# EAGLE schematic SNCHN_II-01 (EAGLE 5.11)
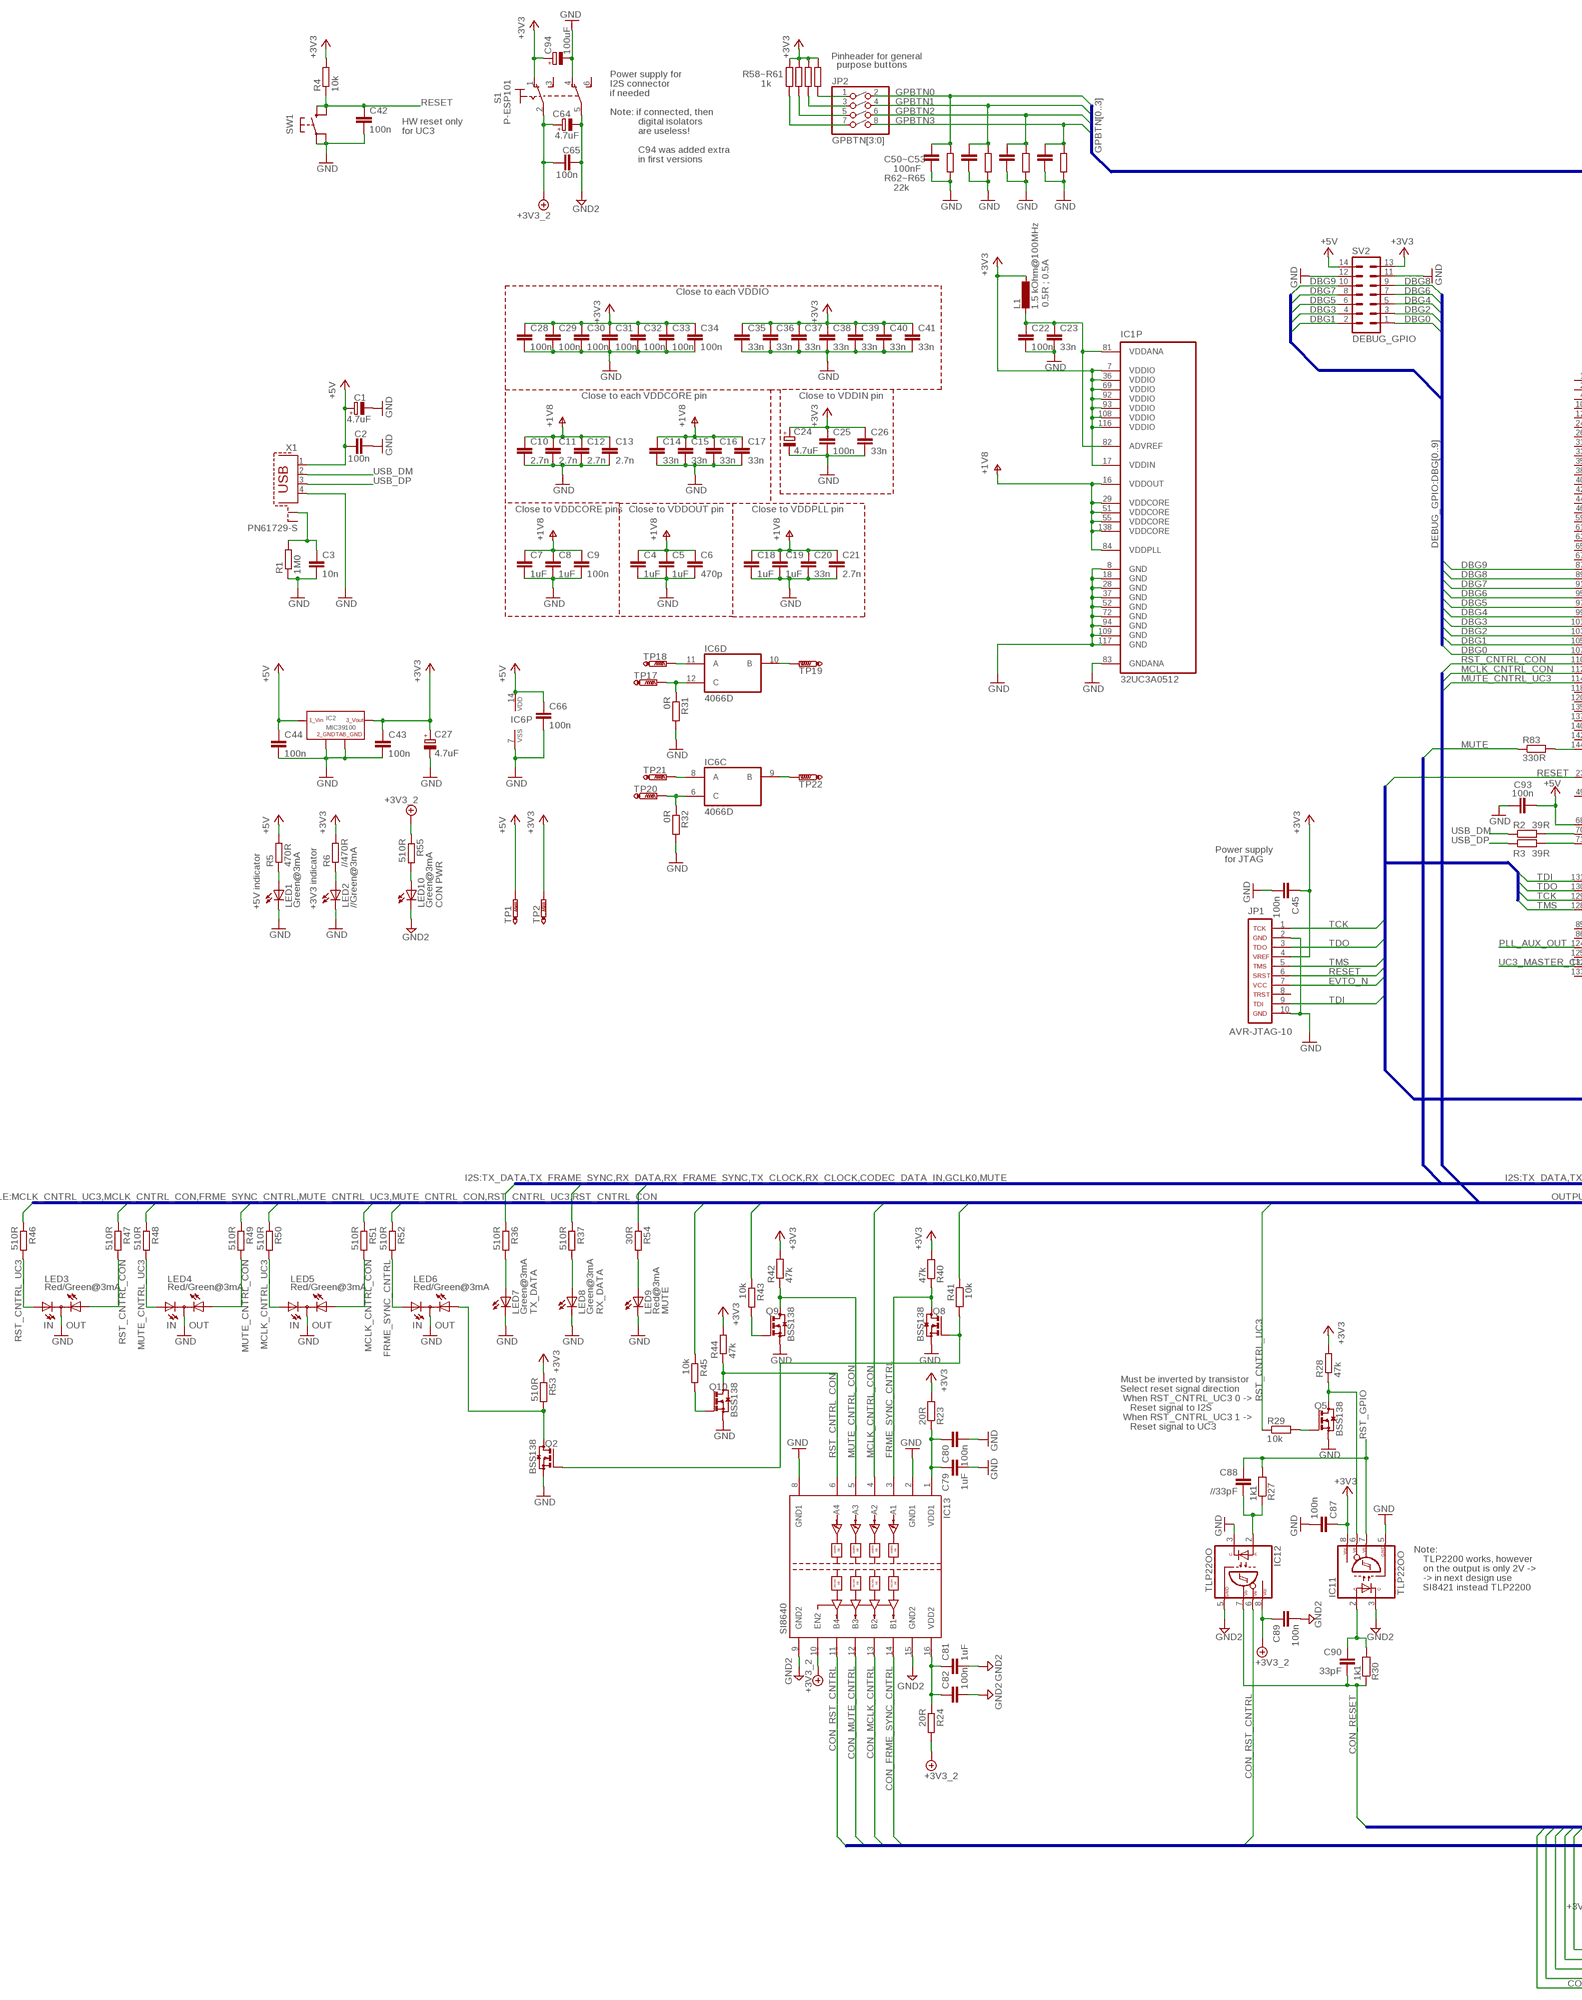
[diagram p0: schematic, sheet 1, part 1 of 3]
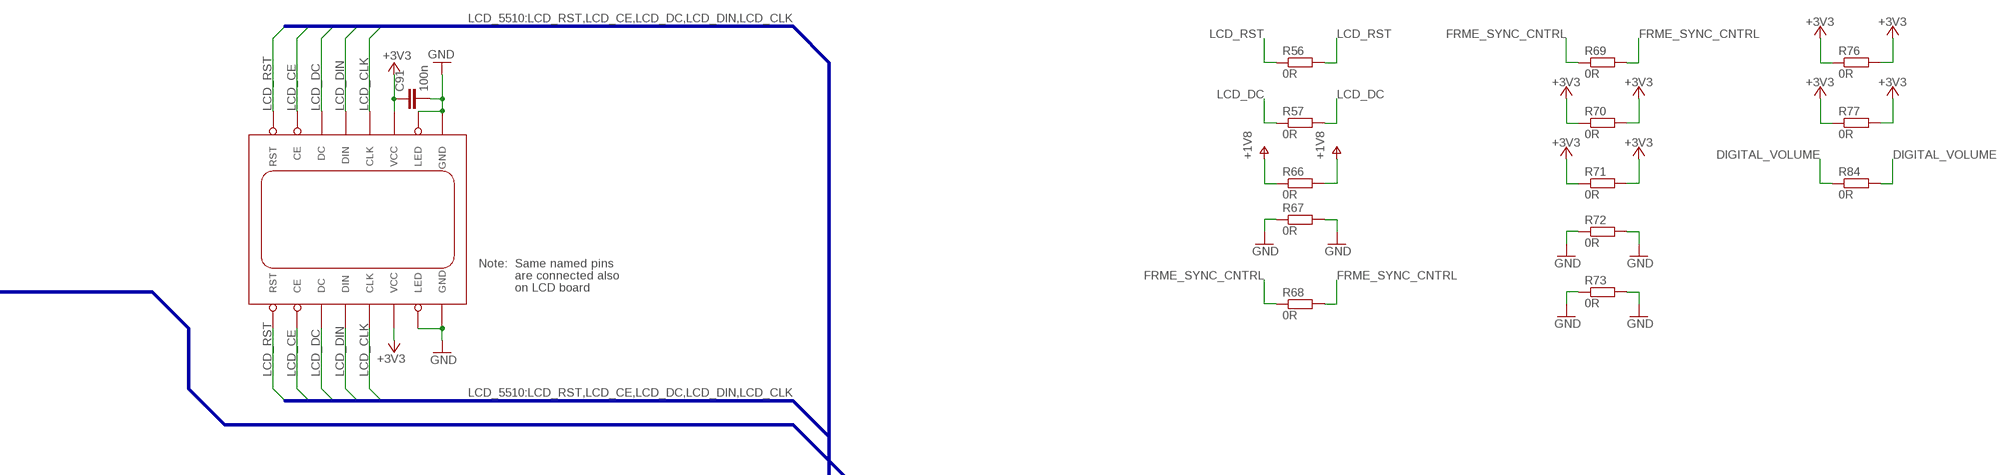
[diagram p1: schematic, sheet 1, part 2 of 3]
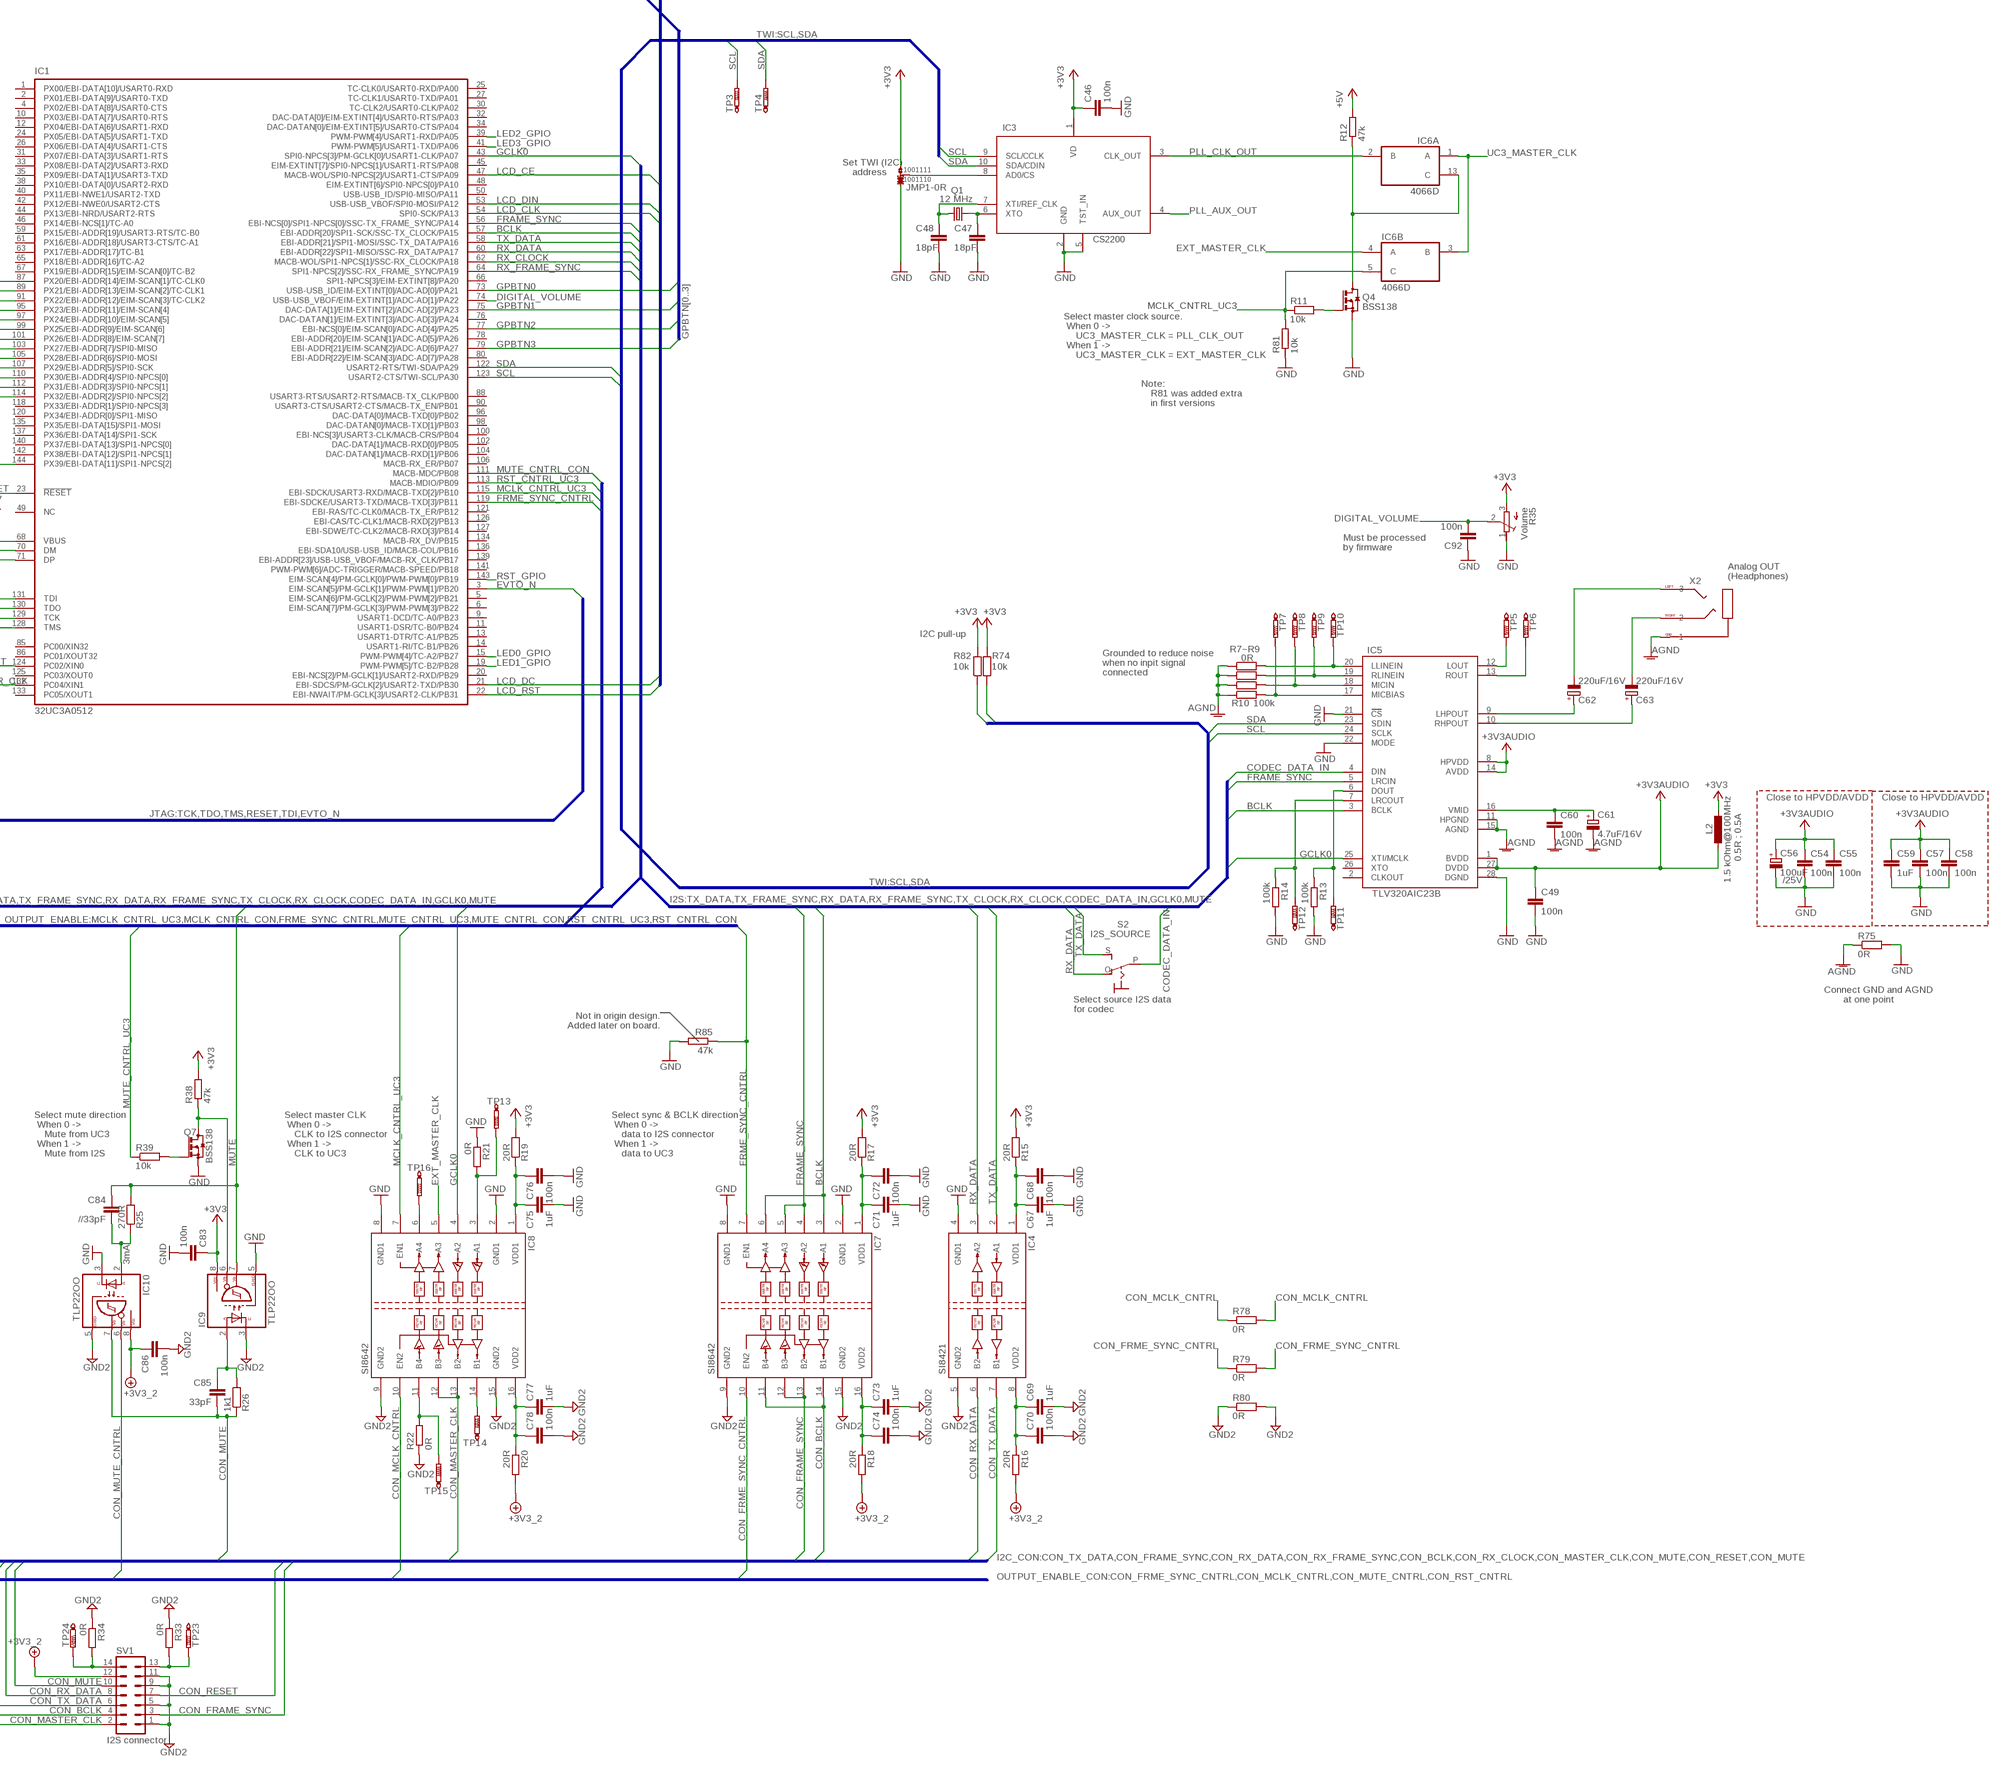
[diagram p2: schematic, sheet 1, part 3 of 3]

## Parts
C1  4.7uF  CPOL-EUA/3216-18R  [A/3216-18R]
C2  100n  C0402  [C0402K]
C3  10n  C0402  [C0402K]
C4  1uF  C0603R  [C0603R]
C5  1uF  C0603R  [C0603R]
C6  470p  C0402  [C0402K]
C7  1uF  C0603R  [C0603R]
C8  1uF  C0603R  [C0603R]
C9  100n  C0402  [C0402K]
C10  2.7n  C0402  [C0402K]
C11  2.7n  C0402  [C0402K]
C12  2.7n  C0402  [C0402K]
C13  2.7n  C0402  [C0402K]
C14  33n  C0402  [C0402K]
C15  33n  C0402  [C0402K]
C16  33n  C0402  [C0402K]
C17  33n  C0402  [C0402K]
C18  1uF  C0603R  [C0603R]
C19  1uF  C0603R  [C0603R]
C20  33n  C0402  [C0402K]
C21  2.7n  C0402  [C0402K]
C22  100n  C0402  [C0402K]
C23  33n  C0402  [C0402K]
C24  4.7uF  CPOL-EUA/3216-18R  [A/3216-18R]
C25  100n  C0402  [C0402K]
C26  33n  C0402  [C0402K]
C27  4.7uF  CPOL-EUA/3216-18R  [A/3216-18R]
C28  100n  C0402  [C0402K]
C29  100n  C0402  [C0402K]
C30  100n  C0402  [C0402K]
C31  100n  C0402  [C0402K]
C32  100n  C0402  [C0402K]
C33  100n  C0402  [C0402K]
C34  100n  C0402  [C0402K]
C35  33n  C0402  [C0402K]
C36  33n  C0402  [C0402K]
C37  33n  C0402  [C0402K]
C38  33n  C0402  [C0402K]
C39  33n  C0402  [C0402K]
C40  33n  C0402  [C0402K]
C41  33n  C0402  [C0402K]
C42  100n  C0402  [C0402K]
C43  100n  C0402  [C0402K]
C44  100n  C0402  [C0402K]
C45  100n  C0402  [C0402K]
C46  100n  C0402  [C0402K]
C47  18pF  C0402  [C0402K]
C48  18pF  C0402  [C0402K]
C49  100n  C0402  [C0402K]
C50  100n  C0402  [C0402K]
C51  100n  C0402  [C0402K]
C52  100n  C0402  [C0402K]
C53  100n  C0402  [C0402K]
C54  100n  C0402  [C0402K]
C55  100n  C0402  [C0402K]
C56  100uF  CPOL-EUD/7343-31R  [D/7343-31R]
C57  100n  C0402  [C0402K]
C58  100n  C0402  [C0402K]
C59  1uF  C0603R  [C0603R]
C60  100n  C0402  [C0402K]
C61  4.7uF/16V  CPOL-EUA/3216-18R  [A/3216-18R]
C62  220uF/16V  CPOL-EU140CLH-1010  [140CLH-1010]
C63  220uF/16V  CPOL-EU140CLH-1010  [140CLH-1010]
C64  4.7uF  CPOL-EUA/3216-18R  [A/3216-18R]
C65  100n  C0402  [C0402K]
C66  100n  C0402  [C0402K]
C67  1uF  C0603R  [C0603R]
C68  100n  C0402  [C0402K]
C69  1uF  C0603R  [C0603R]
C70  100n  C0402  [C0402K]
C71  1uF  C0603R  [C0603R]
C72  100n  C0402  [C0402K]
C73  1uF  C0603R  [C0603R]
C74  100n  C0402  [C0402K]
C75  1uF  C0603R  [C0603R]
C76  100n  C0402  [C0402K]
C77  1uF  C0603R  [C0603R]
C78  100n  C0402  [C0402K]
C79  1uF  C0603R  [C0603R]
C80  100n  C0402  [C0402K]
C81  1uF  C0603R  [C0603R]
C82  100n  C0402  [C0402K]
C83  100n  C0402  [C0402K]
C84  //33pF  C0402  [C0402K]
C85  33pF  C0402  [C0402K]
C86  100n  C0402  [C0402K]
C87  100n  C0402  [C0402K]
C88  //33pF  C0402  [C0402K]
C89  100n  C0402  [C0402K]
C90  33pF  C0402  [C0402K]
C91  100n  C0402  [C0402K]
C92  100n  C0402  [C0402K]
C93  100n  C0402  [C0402K]
C94  100uF  CPOL-EUD/7343-31R  [D/7343-31R]
DIS1  LCD_NOKIA_5510  [LCD_NOKIA_5510_PLUS_EXT_BRD]
IC1  32UC3A0512  AT32UC3A0128/0256/0512  [LQFP144]
IC2  MIC39100  [SOT223(S)]
IC3  CS2200  [MSOP10]
IC4  SI8421  [SOIC8]
IC5  TLV320AIC23B  TLV320AIC23BTSSOP  [TSSOP28]
IC6  4066D  [SO14]
IC7  SI8642  [QSOP16]
IC8  SI8642  [QSOP16]
IC9  TLP22OO  [DIL08]
IC10  TLP22OO  [DIL08]
IC11  TLP22OO  [DIL08]
IC12  TLP22OO  [DIL08]
IC13  SI8640  SI8640SOIC16N  [SOIC16N]
JMP1  0R-JUMPA  [A0R-JMP]
JP1  AVR-JTAG-10  [AVR-JTAG-10]
JP2  GPBTN[3:0]  PINHD-2X4  [2X04]
L1  1.5 kOhm@100MHz  L0603  [L0603]
L2  1.5 kOhm@100MHz  L0603  [L0603]
LED1  Green@3mA  LED0603  [LED-0603]
LED2  //Green@3mA  LED0603  [LED-0603]
LED3  Red/Green@3mA  DUO_LED_C3MM  [DUOLED-C-3MM]
LED4  Red/Green@3mA  DUO_LED_C3MM  [DUOLED-C-3MM]
LED5  Red/Green@3mA  DUO_LED_C3MM  [DUOLED-C-3MM]
LED6  Red/Green@3mA  DUO_LED_C3MM  [DUOLED-C-3MM]
LED7  Green@3mA  LED3MM  [LED3MM]
LED8  Green@3mA  LED3MM  [LED3MM]
LED9  Red@3mA  LED3MM  [LED3MM]
LED10  Green@3mA  LED3MM  [LED3MM]
Q1  12 MHz  CRYSTALHC49UP  [HC49UP]
Q2  BSS138  BSS123  [SOT23]
Q4  BSS138  BSS123  [SOT23]
Q5  BSS138  BSS123  [SOT23]
Q7  BSS138  BSS123  [SOT23]
Q8  BSS138  BSS123  [SOT23]
Q9  BSS138  BSS123  [SOT23]
Q10  BSS138  BSS123  [SOT23]
R1  1M0  R0402  [R0402]
R2  39R  R0402  [R0402]
R3  39R  R0402  [R0402]
R4  10k  R0402  [R0402]
R5  470R  R0402  [R0402]
R6  //470R  R0402  [R0402]
R7  0R  R0805  [R0805]
R8  0R  R0805  [R0805]
R9  0R  R0805  [R0805]
R10  100k  R0805  [R0805]
R11  10k  R0402  [R0402]
R12  47k  R0402  [R0402]
R13  100k  R0805  [R0805]
R14  100k  R0805  [R0805]
R15  20R  R0402  [R0402]
R16  20R  R0402  [R0402]
R17  20R  R0402  [R0402]
R18  20R  R0402  [R0402]
R19  20R  R0603  [R0603]
R20  20R  R0402  [R0402]
R21  0R  R0805  [R0805]
R22  0R  R0805  [R0805]
R23  20R  R0402  [R0402]
R24  20R  R0402  [R0402]
R25  270R  R0402  [R0402]
R26  1k1  R0402  [R0402]
R27  1k1  R0402  [R0402]
R28  47k  R0603  [R0603]
R29  10k  R0603  [R0603]
R30  1k1  R0402  [R0402]
R31  0R  R0805  [R0805]
R32  0R  R0805  [R0805]
R33  0R  R0805  [R0805]
R34  0R  R0805  [R0805]
R35  Volume  R-TRIMTRIM_3352T  [TRIM_3352T]
R36  510R  R0402  [R0402]
R37  510R  R0603  [R0603]
R38  47k  R0402  [R0402]
R39  10k  R0603  [R0603]
R40  47k  R0402  [R0402]
R41  10k  R0402  [R0402]
R42  47k  R0402  [R0402]
R43  10k  R0402  [R0402]
R44  47k  R0402  [R0402]
R45  10k  R0402  [R0402]
R46  510R  R0402  [R0402]
R47  510R  R0603  [R0603]
R48  510R  R0402  [R0402]
R49  510R  R0603  [R0603]
R50  510R  R0603  [R0603]
R51  510R  R0402  [R0402]
R52  510R  R0402  [R0402]
R53  510R  R0402  [R0402]
R54  30R  R0402  [R0402]
R55  510R  R0402  [R0402]
R56  0R  R0603  [R0603]
R57  0R  R0603  [R0603]
R58  1k  R0402  [R0402]
R59  1k  R0402  [R0402]
R60  1k  R0402  [R0402]
R61  1k  R0402  [R0402]
R62  22k  R0402  [R0402]
R63  22k  R0402  [R0402]
R64  22k  R0402  [R0402]
R65  22k  R0402  [R0402]
R66  0R  R0603  [R0603]
R67  0R  R1206  [R1206]
R68  0R  R0603  [R0603]
R69  0R  R0603  [R0603]
R70  0R  R1206  [R1206]
R71  0R  R0603  [R0603]
R72  0R  R0603  [R0603]
R73  0R  R1206  [R1206]
R74  10k  R-EU_R0603  [R0603]
R75  0R  R0603  [R0603]
R76  0R  R0603  [R0603]
R77  0R  R0603  [R0603]
R78  0R  R0603  [R0603]
R79  0R  R0603  [R0603]
R80  0R  R0603  [R0603]
R81  10k  R0402  [R0402]
R82  10k  R0402  [R0402]
R83  330R  R0402  [R0402]
R84  0R  R1206  [R1206]
R85  47k  R0402  [R0402]
S1  P-ESP101  SLIDE_SWITCH_THRUHOLE  [JS202011AQN]
S2  I2S_SOURCE  SLIDE_SWITCH_THRUHOLE_1_POLE_HORIZONTAL  [P-ESP201X]
SV1  I2S connector  ML14L  [ML14L]
SV2  DEBUG_GPIO  ML14L  [ML14L]
SW1  B1720SMD  [B1720/SMD]
TP1  PTR1B1,27  [B1,27]
TP2  PTR1B1,27  [B1,27]
TP3  PTR1PAD1-13  [P1-13]
TP4  PTR1PAD1-13  [P1-13]
TP5  PTR1B1,27  [B1,27]
TP6  PTR1B1,27  [B1,27]
TP7  PTR1B1,27  [B1,27]
TP8  PTR1B1,27  [B1,27]
TP9  PTR1B1,27  [B1,27]
TP10  PTR1B1,27  [B1,27]
TP11  PTR1B1,27  [B1,27]
TP12  PTR1B1,27  [B1,27]
TP13  PTR1B1,27  [B1,27]
TP14  PTR1B1,27  [B1,27]
TP15  PTR1B1,27  [B1,27]
TP16  PTR1B1,27  [B1,27]
TP17  PTR1B1,27  [B1,27]
TP18  PTR1B1,27  [B1,27]
TP19  PTR1B1,27  [B1,27]
TP20  PTR1B1,27  [B1,27]
TP21  PTR1B1,27  [B1,27]
TP22  PTR1B1,27  [B1,27]
TP23  PTR1B1,27  [B1,27]
TP24  PTR1B1,27  [B1,27]
X1  PN61729-S  [PN61729-S]
X2  JACK_CON_3.5MM_3PIN  [STEREO_JACK_3.5MM_SMD_SJ-352X-SMT]

## Nets
+1V8: C4.1 C5.1 C6.1 C7.1 C8.1 C9.1 C10.1 C11.1 C12.1 C13.1 C14.1 C15.1 C16.1 C17.1 C18.1 C19.1 C20.1 C21.1 IC1.16(VDDOUT) IC1.29(VDDCORE) IC1.51(VDDCORE) IC1.55(VDDCORE) IC1.84(VDDPLL) IC1.138(VDDCORE) R66.1 R66.2
+3V3: C24.+ C25.1 C26.1 C27.+ C28.1 C29.1 C30.1 C31.1 C32.1 C33.1 C34.1 C35.1 C36.1 C37.1 C38.1 C39.1 C40.1 C41.1 C43.1 C45.1 C46.1 C83.1 C87.1 C91.1 C94.+ DIS1.6(VCC) DIS1.6@1(VCC) IC1.7(VDDIO) IC1.17(VDDIN) IC1.36(VDDIO) IC1.69(VDDIO) IC1.92(VDDIO) IC1.93(VDDIO) IC1.108(VDDIO) IC1.116(VDDIO) IC2.3 IC3.1(VD) IC9.8(VCC) IC11.8(VCC) JMP1.3 JP1.4 L1.1 L2.1 R4.2 R6.2 R15.2 R17.2 R19.2 R23.2 R28.2 R35.3 R38.2 R40.2 R42.2 R44.2 R53.1 R58.2 R59.2 R60.2 R61.2 R70.1 R70.2 R71.1 R71.2 R74.2 R76.1 R76.2 R77.1 R77.2 R82.2 S1.1(O) SV2.13 TP2.PP(TP)
+3V3_2: C64.+ C65.1 C86.1 C89.1 IC10.8(VCC) IC12.8(VCC) IC13.10(EN2) R16.2 R18.2 R20.2 R24.2 R55.1 S1.2(P) SV1.12
+3V3AUDIO: C49.1 C54.1 C55.1 C56.+ C57.1 C58.1 C59.1 IC5.1(BVDD) IC5.8(HPVDD) IC5.14(AVDD) IC5.27(DVDD) L2.2
+5V: C1.+ C2.1 C44.1 C66.1 C93.2 IC1.68(VBUS) IC2.1 IC6.14(P:VDD) R5.2 R12.2 SV2.14 TP1.PP(TP) X1.1
AGND: C60.2 C61.- IC5.11(HPGND) IC5.15(AGND) R7.1 R8.1 R9.1 R10.1 R75.1 X2.P$1
BCLK: IC1.57(EBI-ADDR[20]/SPI1-SCK/SSC-TX_CLOCK/PA15) IC5.3(BCLK) IC7.3(A1) IC7.6(A4)
CODEC_DATA_IN: IC5.4(DIN) S2.P
CON_BCLK: IC7.11(B4) IC7.14(B1) SV1.4
CON_FRAME_SYNC: IC7.12(B3) IC7.13(B2) SV1.3
CON_FRME_SYNC_CNTRL: IC7.10(EN2) IC13.14(B1) R79.1 R79.2
CON_MASTER_CLK: IC8.12(B3) IC8.13(B2) SV1.2
CON_MCLK_CNTRL: IC8.10(EN2) IC13.13(B2) R78.1 R78.2
CON_MUTE: C85.2 IC10.7(VO) R26.1 SV1.10
CON_MUTE_CNTRL: IC10.6(VE) IC13.12(B3)
CON_RESET: C90.2 IC12.7(VO) R30.1 SV1.7
CON_RST_CNTRL: IC12.6(VE) IC13.11(B4)
CON_RX_DATA: IC4.6(B2) SV1.8
CON_TX_DATA: IC4.7(B1) SV1.6
DBG0: IC1.107(PX29/EBI-ADDR[5]/SPI0-SCK) SV2.1
DBG1: IC1.105(PX28/EBI-ADDR[6]/SPI0-MOSI) SV2.2
DBG2: IC1.103(PX27/EBI-ADDR[7]/SPI0-MISO) SV2.3
DBG3: IC1.101(PX26/EBI-ADDR[8]/EIM-SCAN[7]) SV2.4
DBG4: IC1.99(PX25/EBI-ADDR[9]/EIM-SCAN[6]) SV2.5
DBG5: IC1.97(PX24/EBI-ADDR[10]/EIM-SCAN[5]) SV2.6
DBG6: IC1.95(PX23/EBI-ADDR[11]/EIM-SCAN[4]) SV2.7
DBG7: IC1.91(PX22/EBI-ADDR[12]/EIM-SCAN[3]/TC-CLK2) SV2.8
DBG8: IC1.89(PX21/EBI-ADDR[13]/EIM-SCAN[2]/TC-CLK1) SV2.9
DBG9: IC1.87(PX20/EBI-ADDR[14]/EIM-SCAN[1]/TC-CLK0) SV2.10
DIGITAL_VOLUME: C92.2 IC1.74(USB-USB_VBOF/EIM-EXTINT[1]/ADC-AD[1]/PA22) R35.2 R84.1 R84.2
EVTO_N: IC1.3(EIM-SCAN[5]/PM-GCLK[1]/PWM-PWM[1]/PB20) JP1.7
EXT_MASTER_CLK: IC6.4(B:A) IC8.5(A3)
FRAME_SYNC: IC1.56(EBI-NCS[0]/SPI1-NPCS[0]/SSC-TX_FRAME_SYNC/PA14) IC5.5(LRCIN) IC7.4(A2) IC7.5(A3)
FRME_SYNC_CNTRL: IC1.119(EBI-SDCKE/USART3-TXD/MACB-TXD[3]/PB11) IC7.7(EN1) R41.1 R52.1 R68.1 R68.2 R69.1 R69.2 R85.1
GCLK0: IC1.43(SPI0-NPCS[3]/PM-GCLK[0]/USART1-CLK/PA07) IC5.25(XTI/MCLK) IC8.4(A2)
GND: C1.- C2.2 C3.2 C4.2 C5.2 C6.2 C7.2 C8.2 C9.2 C10.2 C11.2 C12.2 C13.2 C14.2 C15.2 C16.2 C17.2 C18.2 C19.2 C20.2 C21.2 C22.2 C23.2 C24.- C25.2 C26.2 C27.- C28.2 C29.2 C30.2 C31.2 C32.2 C33.2 C34.2 C35.2 C36.2 C37.2 C38.2 C39.2 C40.2 C41.2 C42.2 C43.2 C44.2 C45.2 C46.2 C47.2 C48.2 C49.2 C50.2 C51.2 C52.2 C53.2 C54.2 C55.2 C56.- C57.2 C58.2 C59.2 C66.2 C67.2 C68.2 C71.2 C72.2 C75.2 C76.2 C79.2 C80.2 C83.2 C87.2 C91.2 C92.1 C93.1 C94.- DIS1.7(LED) DIS1.7@1(LED) DIS1.8(GND) DIS1.8@1(GND) IC1.8(GND) IC1.18(GND) IC1.28(GND) IC1.37(GND) IC1.52(GND) IC1.72(GND) IC1.83(GNDANA) IC1.94(GND) IC1.109(GND) IC1.117(GND) IC2.2 IC2.4 IC3.2(GND) IC3.5(TST_IN) IC4.4(GND1) IC5.21(CS) IC5.22(MODE) IC5.28(DGND) IC6.7(P:VSS) IC7.2(GND1) IC7.8(GND1) IC8.2(GND1) IC8.8(GND1) IC9.5(GND) IC10.3(C) IC11.5(GND) IC12.3(C) IC13.2(GND1) IC13.8(GND1) JMP1.1 JP1.2 JP1.10 LED1.C LED2.C LED3.C LED4.C LED5.C LED6.C LED7.K(C) LED8.K(C) LED9.K(C) Q2.2(S) Q4.2(S) Q5.2(S) Q7.2(S) Q8.2(S) Q9.2(S) Q10.2(S) R1.1 R13.2 R14.2 R21.1 R31.2 R32.2 R35.1 R62.2 R63.2 R64.2 R65.2 R67.1 R67.2 R72.1 R72.2 R73.1 R73.2 R75.2 R81.1 R85.2 S1.4(O1) SV2.11 SV2.12 SW1.P$1 SW1.P$2 X1.4
GND2: C64.- C65.2 C69.2 C70.2 C73.2 C74.2 C77.2 C78.2 C81.2 C82.2 C86.2 C89.2 IC4.5(GND2) IC7.9(GND2) IC7.15(GND2) IC8.9(GND2) IC8.15(GND2) IC9.3(C) IC10.5(GND) IC11.3(C) IC12.5(GND) IC13.9(GND2) IC13.15(GND2) LED10.K(C) R22.1 R33.1 R34.1 R80.1 R80.2 S1.5(P1) SV1.1 SV1.5 SV1.9 SV1.11
GPBTN0: C50.1 IC1.73(USB-USB_ID/EIM-EXTINT[0]/ADC-AD[0]/PA21) JP2.2 R62.1
GPBTN1: C51.1 IC1.75(DAC-DATA[1]/EIM-EXTINT[2]/ADC-AD[2]/PA23) JP2.4 R63.1
GPBTN2: C52.1 IC1.77(EBI-NCS[0]/EIM-SCAN[0]/ADC-AD[4]/PA25) JP2.6 R64.1
GPBTN3: C53.1 IC1.79(EBI-ADDR[21]/EIM-SCAN[2]/ADC-AD[6]/PA27) JP2.8 R65.1
LCD_CE: DIS1.2(CE) DIS1.2@1(CE) IC1.47(MACB-WOL/SPI0-NPCS[2]/USART1-CTS/PA09)
LCD_CLK: DIS1.5(CLK) DIS1.5@1(CLK) IC1.54(SPI0-SCK/PA13)
LCD_DC: DIS1.3(DC) DIS1.3@1(DC) IC1.21(EBI-SDCS/PM-GCLK[2]/USART2-TXD/PB30) R57.1 R57.2
LCD_DIN: DIS1.4(DIN) DIS1.4@1(DIN) IC1.53(USB-USB_VBOF/SPI0-MOSI/PA12)
LCD_RST: DIS1.1(RST) DIS1.1@1(RST) IC1.22(EBI-NWAIT/PM-GCLK[3]/USART2-CLK/PB31) R56.1 R56.2
LED0_GPIO: IC1.15(PWM-PWM[4]/TC-A2/PB27)
LED1_GPIO: IC1.19(PWM-PWM[5]/TC-B2/PB28)
LED2_GPIO: IC1.39(PWM-PWM[4]/USART1-RXD/PA05)
LED3_GPIO: IC1.41(PWM-PWM[5]/USART1-TXD/PA06)
MCLK_CNTRL_CON: IC1.112(PX31/EBI-ADDR[3]/SPI0-NPCS[1]) IC13.4(A2) R51.1
MCLK_CNTRL_UC3: IC1.115(EBI-SDCK/USART3-RXD/MACB-TXD[2]/PB10) IC6.5(B:C) IC8.7(EN1) R11.1 R50.1 R81.2
MUTE: C84.1 IC9.7(VO) R25.2 R54.1 R83.1
MUTE_CNTRL_CON: IC1.111(MACB-MDC/PB08) R43.1 R49.1
MUTE_CNTRL_UC3: IC1.114(PX32/EBI-ADDR[2]/SPI0-NPCS[2]) R39.1 R48.1
MUTE_UC3: IC1.144(PX39/EBI-DATA[11]/SPI1-NPCS[2]) R83.2
N$1: C3.1 R1.2 X1.S1
N$2: IC1.70(DM) R2.2
N$3: IC1.71(DP) R3.2
N$4: C22.1 C23.1 IC1.81(VDDANA) IC1.82(ADVREF) L1.2
N$5: LED1.A R5.1
N$6: LED2.A R6.1
N$7: C47.1 IC3.6(XTO) Q1.1
N$8: C48.1 IC3.7(XTI/REF_CLK) Q1.2
N$9: IC3.8(AD0/CS) JMP1.2
N$10: LED9.A R54.2
N$11: C60.1 C61.+ IC5.16(VMID)
N$12: LED10.A R55.2
N$13: C62.+ IC5.9(LHPOUT)
N$14: C63.+ IC5.10(RHPOUT)
N$15: IC5.20(LLINEIN) R7.2 TP10.PP(TP)
N$16: IC5.19(RLINEIN) R8.2 TP9.PP(TP)
N$17: IC5.18(MICIN) R9.2 TP8.PP(TP)
N$18: IC5.17(MICBIAS) R10.2 TP7.PP(TP)
N$19: IC5.12(LOUT) TP5.PP(TP)
N$20: IC5.13(ROUT) TP6.PP(TP)
N$21: IC6.13(A:C) Q4.3(D) R12.1
N$22: C63.- X2.P$3
N$23: C62.- X2.P$2
N$24: C67.1 C68.1 IC4.1(VDD1) R15.1
N$25: Q4.1(G) R11.2
N$26: C71.1 C72.1 IC7.1(VDD1) R17.1
N$27: IC5.6(DOUT) R13.1 TP11.PP(TP)
N$28: IC5.7(LRCOUT) R14.1 TP12.PP(TP)
N$29: C69.1 C70.1 IC4.8(VDD2) R16.1
N$30: C73.1 C74.1 IC7.16(VDD2) R18.1
N$31: IC8.3(A1) R21.2 TP13.PP(TP)
N$32: C79.1 C80.1 IC13.1(VDD1) R23.1
N$33: C81.1 C82.1 IC13.16(VDD2) R24.1
N$34: IC8.14(B1) TP14.PP(TP)
N$35: C75.1 C76.1 IC8.1(VDD1) R19.1
N$36: C77.1 C78.1 IC8.16(VDD2) R20.1
N$37: IC8.11(B4) R22.2 TP15.PP(TP)
N$38: IC8.6(A4) TP16.PP(TP)
N$39: C88.2 IC12.2(A) R27.1
N$40: C84.2 IC10.2(A) R25.1
N$41: LED7.A R36.2
N$42: Q5.1(G) R29.2
N$43: C85.1 IC9.2(A) R26.2
N$44: IC11.6(VE) Q5.3(D) R28.1
N$45: C90.1 IC11.2(A) R30.2
N$46: LED8.A R37.2
N$47: Q7.1(G) R39.2
N$48: R34.2 SV1.14 TP24.PP(TP)
N$49: R33.2 SV1.13 TP23.PP(TP)
N$50: IC9.6(VE) Q7.3(D) R38.1
N$51: Q2.1(G) Q8.1(G) R41.2
N$52: IC13.3(A1) Q8.3(D) R40.1
N$53: IC6.12(D:C) R31.1 TP17.PP(TP)
N$54: IC6.10(D:B) TP19.PP(TP)
N$55: IC6.11(D:A) TP18.PP(TP)
N$56: IC6.6(C:C) R32.1 TP20.PP(TP)
N$57: IC6.8(C:A) TP21.PP(TP)
N$58: IC6.9(C:B) TP22.PP(TP)
N$59: IC13.5(A3) Q9.3(D) R42.1
N$60: Q9.1(G) R43.2
N$61: IC13.6(A4) Q10.3(D) R44.1
N$62: Q10.1(G) R45.2
N$63: LED6.AR Q2.3(D) R53.2
N$64: LED6.AX R52.2
N$65: LED5.AX R50.2
N$66: LED5.AR R51.2
N$67: LED4.AR R49.2
N$68: LED4.AX R48.2
N$69: LED3.AR R47.2
N$70: LED3.AX R46.2
N$72: JP2.1 R58.1
N$73: JP2.3 R59.1
N$74: JP2.5 R60.1
N$75: JP2.7 R61.1
PLL_AUX_OUT: IC1.124(PC02/XIN0) IC3.4(AUX_OUT)
PLL_CLK_OUT: IC3.3(CLK_OUT) IC6.2(A:B)
RESET: C42.1 IC1.23(!RESET) JP1.6 R4.1 SW1.P$3 SW1.P$4
RST_CNTRL_CON: IC1.110(PX30/EBI-ADDR[4]/SPI0-NPCS[0]) R45.1 R47.1
RST_CNTRL_UC3: IC1.113(MACB-MDIO/PB09) R29.1 R46.1
RST_GPIO: C88.1 IC1.143(EIM-SCAN[4]/PM-GCLK[0]/PWM-PWM[0]/PB19) IC11.7(VO) R27.2
RX_CLOCK: IC1.62(MACB-WOL/SPI1-NPCS[1]/SSC-RX_CLOCK/PA18)
RX_DATA: IC1.60(EBI-ADDR[22]/SPI1-MISO/SSC-RX_DATA/PA17) IC4.3(A2) R37.1 S2.O
RX_FRAME_SYNC: IC1.64(SPI1-NPCS[2]/SSC-RX_FRAME_SYNC/PA19)
SCL: IC1.123(USART2-CTS/TWI-SCL/PA30) IC3.9(SCL/CCLK) IC5.24(SCLK) R74.1 TP3.1(TP)
SDA: IC1.122(USART2-RTS/TWI-SDA/PA29) IC3.10(SDA/CDIN) IC5.23(SDIN) R82.1 TP4.1(TP)
TCK: IC1.129(TCK) JP1.1
TDI: IC1.131(TDI) JP1.9
TDO: IC1.130(TDO) JP1.3
TMS: IC1.128(TMS) JP1.5
TX_DATA: IC1.58(EBI-ADDR[21]/SPI1-MOSI/SSC-TX_DATA/PA16) IC4.2(A1) R36.1 S2.S
UC3_MASTER_CLK: IC1.132(PC04/XIN1) IC6.1(A:A) IC6.3(B:B)
USB_DM: R2.1 X1.2
USB_DP: R3.1 X1.3
Unconnected: IC1.1(PX00/EBI-DATA[10]/USART0-RXD) IC1.2(PX01/EBI-DATA[9]/USART0-TXD) IC1.4(PX02/EBI-DATA[8]/USART0-CTS) IC1.5(EIM-SCAN[6]/PM-GCLK[2]/PWM-PWM[2]/PB21) IC1.6(EIM-SCAN[7]/PM-GCLK[3]/PWM-PWM[3]/PB22) IC1.9(USART1-DCD/TC-A0/PB23) IC1.10(PX03/EBI-DATA[7]/USART0-RTS) IC1.11(USART1-DSR/TC-B0/PB24) IC1.12(PX04/EBI-DATA[6]/USART1-RXD) IC1.13(USART1-DTR/TC-A1/PB25) IC1.14(USART1-RI/TC-B1/PB26) IC1.20(EBI-NCS[2]/PM-GCLK[1]/USART2-RXD/PB29) IC1.24(PX05/EBI-DATA[5]/USART1-TXD) IC1.25(TC-CLK0/USART0-RXD/PA00) IC1.26(PX06/EBI-DATA[4]/USART1-CTS) IC1.27(TC-CLK1/USART0-TXD/PA01) IC1.30(TC-CLK2/USART0-CLK/PA02) IC1.31(PX07/EBI-DATA[3]/USART1-RTS) IC1.32(DAC-DATA[0]/EIM-EXTINT[4]/USART0-RTS/PA03) IC1.33(PX08/EBI-DATA[2]/USART3-RXD) IC1.34(DAC-DATAN[0]/EIM-EXTINT[5]/USART0-CTS/PA04) IC1.35(PX09/EBI-DATA[1]/USART3-TXD) IC1.38(PX10/EBI-DATA[0]/USART2-RXD) IC1.40(PX11/EBI-NWE1/USART2-TXD) IC1.42(PX12/EBI-NWE0/USART2-CTS) IC1.44(PX13/EBI-NRD/USART2-RTS) IC1.45(EIM-EXTINT[7]/SPI0-NPCS[1]/USART1-RTS/PA08) IC1.46(PX14/EBI-NCS[1]/TC-A0) IC1.48(EIM-EXTINT[6]/SPI0-NPCS[0]/PA10) IC1.49(NC) IC1.50(USB-USB_ID/SPI0-MISO/PA11) IC1.59(PX15/EBI-ADDR[19]/USART3-RTS/TC-B0) IC1.61(PX16/EBI-ADDR[18]/USART3-CTS/TC-A1) IC1.63(PX17/EBI-ADDR[17]/TC-B1) IC1.65(PX18/EBI-ADDR[16]/TC-A2) IC1.66(SPI1-NPCS[3]/EIM-EXTINT[8]/PA20) IC1.67(PX19/EBI-ADDR[15]/EIM-SCAN[0]/TC-B2) IC1.76(DAC-DATAN[1]/EIM-EXTINT[3]/ADC-AD[3]/PA24) IC1.78(EBI-ADDR[20]/EIM-SCAN[1]/ADC-AD[5]/PA26) IC1.80(EBI-ADDR[22]/EIM-SCAN[3]/ADC-AD[7]/PA28) IC1.85(PC00/XIN32) IC1.86(PC01/XOUT32) IC1.88(USART3-RTS/USART2-RTS/MACB-TX_CLK/PB00) IC1.90(USART3-CTS/USART2-CTS/MACB-TX_EN/PB01) IC1.96(DAC-DATA[0]/MACB-TXD[0]/PB02) IC1.98(DAC-DATAN[0]/MACB-TXD[1]/PB03) IC1.100(EBI-NCS[3]/USART3-CLK/MACB-CRS/PB04) IC1.102(DAC-DATA[1]/MACB-RXD[0]/PB05) IC1.104(DAC-DATAN[1]/MACB-RXD[1]/PB06) IC1.106(MACB-RX_ER/PB07) IC1.118(PX33/EBI-ADDR[1]/SPI0-NPCS[3]) IC1.120(PX34/EBI-ADDR[0]/SPI1-MISO) IC1.121(EBI-RAS/TC-CLK0/MACB-TX_ER/PB12) IC1.125(PC03/XOUT0) IC1.126(EBI-CAS/TC-CLK1/MACB-RXD[2]/PB13) IC1.127(EBI-SDWE/TC-CLK2/MACB-RXD[3]/PB14) IC1.133(PC05/XOUT1) IC1.134(MACB-RX_DV/PB15) IC1.135(PX35/EBI-DATA[15]/SPI1-MOSI) IC1.136(EBI-SDA10/USB-USB_ID/MACB-COL/PB16) IC1.137(PX36/EBI-DATA[14]/SPI1-SCK) IC1.139(EBI-ADDR[23]/USB-USB_VBOF/MACB-RX_CLK/PB17) IC1.140(PX37/EBI-DATA[13]/SPI1-NPCS[0]) IC1.141(PWM-PWM[6]/ADC-TRIGGER/MACB-SPEED/PB18) IC1.142(PX38/EBI-DATA[12]/SPI1-NPCS[1]) IC5.2(CLKOUT) IC5.26(XTO) JP1.8 S1.3(S) S1.6(S1) X1.S2

## Buses
JTAG:TCK,TDO,TMS,RESET,TDI,EVTO_N
TWI:SCL,SDA
I2S:TX_DATA,TX_FRAME_SYNC,RX_DATA,RX_FRAME_SYNC,TX_CLOCK,RX_CLOCK,CODEC_DATA_IN,GCLK0,MUTE
DEBUG_GPIO:DBG[0..9]
LCD_5510:LCD_RST,LCD_CE,LCD_DC,LCD_DIN,LCD_CLK
I2C_CON:CON_TX_DATA,CON_FRAME_SYNC,CON_RX_DATA,CON_RX_FRAME_SYNC,CON_BCLK,CON_RX_CLOCK,CON_MASTER_CLK,CON_MUTE,CON_RESET,CON_MUTE
OUTPUT_ENABLE_CON:CON_FRME_SYNC_CNTRL,CON_MCLK_CNTRL,CON_MUTE_CNTRL,CON_RST_CNTRL
OUTPUT_ENABLE:MCLK_CNTRL_UC3,MCLK_CNTRL_CON,FRME_SYNC_CNTRL,MUTE_CNTRL_UC3,MUTE_CNTRL_CON,RST_CNTRL_UC3,RST_CNTRL_CON
GPBTN[0..3]

## Notes on the sheet
- Pinheader for general
- purpose buttons
- Power supply for | R58~R61
- I2S connector | 1k
- if needed
- Note: if connected, then
- HW reset only | digital isolators
- for UC3 | are useless!
- C94 was added extra | Note: | Same named pins
- in first versions | C50~C53 | are connected also
- 100nF | on LCD board
- R62~R65
- 22k
- Close to each VDDIO
- 0.5R ; 0.5A
- Close to each VDDCORE pin | Close to VDDIN pin
- Set TWI (I2C)
- 1001111
- address
- 1001110
- Close to VDDCORE pins | Close to VDDOUT pin | Close to VDDPLL pin
- Select master clock source.
- When 0 ->
- UC3_MASTER_CLK = PLL_CLK_OUT
- When 1 ->
- UC3_MASTER_CLK = EXT_MASTER_CLK
- Note:
- R81 was added extra
- in first versions
- Must be processed
- by firmware
- Power supply | Analog OUT
- for JTAG | (Headphones)
- +5V indicator | +3V3 indicator | CON PWR
- I2C pull-up
- R7~R9
- Grounded to reduce noise
- 0R
- when no inpit signal
- connected
- Close to HPVDD/AVDD | Close to HPVDD/AVDD
- 0.5R ; 0.5A
- /25V
- Connect GND and AGND
- Select source I2S data | at one point
- Not in origin design. | for codec
- Added later on board.
- IN | OUT | IN | OUT | IN | OUT | IN | OUT
- Must be inverted by transistor
- Select reset signal direction | Select mute direction | Select master CLK | Select sync & BCLK direction
- When RST_CNTRL_UC3 0 -> | When 0 -> | When 0 -> | When 0 ->
- Reset signal to I2S | Mute from UC3 | CLK to I2S connector | data to I2S connector
- When RST_CNTRL_UC3 1 -> | When 1 -> | When 1 -> | When 1 ->
- Reset signal to UC3 | Mute from I2S | CLK to UC3 | data to UC3
- 3mA
- Note:
- TLP2200 works, however
- on the output is only 2V ->
- -> in next design use
- SI8421 instead TLP2200

## Library data of the parts
C1 C24 C27 C56 C61 C64 C94 = _ALCZ_Passives:CPOL-EU: POLARIZED CAPACITOR, European symbol
C2-C23 C25 C26 C28-C55 C57-C60 C65-C93 = _ALCZ_Passives:C: Ordinary capacitors
C62 C63 = resistor:CPOL-EU: POLARIZED CAPACITOR, European symbol
DIS1 = _ALCZ_Display:LCD_NOKIA_5510: Display from NOKIA 5510 Used SPI interface up to 4Mbit/s. LED backlight is turned on by LOW level!
IC1 = atmel-avr32-michel:AT32UC3A0128/0256/0512: AT32UC3A0128/0256/0512
IC2 = _ALCZ_Power_supply_ICs:MIC39100: Linear voltage regulator
IC3 = _ALCZ_Mixed_signal_IC:CS2200: Fractional-N Frequency Synthesizer The CS2200-CP supports both I²C and SPI for full software control. by Martin Stejskal
IC4 = _ALCZ_Optocouplers_digital_isolators:SI8421: Low power dual-channel digital digital isolator up to 150 Mbps Operating supply voltage: 2.7-5.5V up to 2500 Urms isolation byMartin Stejskal
IC5 = _ALCZ_Mixed_signal_IC:TLV320AIC23B: Stereo audio codec 8-96 kHz with integrated amplifier by Martin Stejskal
IC6 = 40xx:4066: Quad bilateral ANALOG SWITCH
IC7 IC8 = _ALCZ_Optocouplers_digital_isolators:SI8642: Low power quad-channel digital digital isolator common output enable up to 150 Mbps Operating supply voltage: 2.7-5.5V up to 5000 Urms isolation byMartin Stejskal
IC9-IC12 = _ALCZ_Optocouplers_digital_isolators:TLP22OO: Isolated buss driver High speed line receiver Microprocessor system interfaces MOS FET Gate Driver Direct Replacement For HCPL-2200 by Martin Stejskal
IC13 = _ALCZ_Optocouplers_digital_isolators:SI8640: Low power quad-channel digital digital isolator common output enable up to 150 Mbps Operating supply voltage: 2.7-5.5V up to 5000 Urms isolation byMartin Stejskal
JMP1 = jump-0r-smd:0R-JUMP: SMD 0R 0805 Jumper
JP1 = atmel-avr32-michel:AVR-JTAG-10: AVR JTAG Debug/Programming Header
JP2 = pinhead:PINHD-2X4: PIN HEADER
L1 L2 = _ALCZ_Passives:L: INDUCTOR chip
LED1 LED2 LED7-LED10 = _ALCZ_Discrete:LED: LEDs Standard schematic elements and footprints for 5mm, 3mm, 1206, and 0603 sized LEDs. 5mm - Spark Fun Electronics SKU : COM-00529 (and others)
LED3-LED6 = _ALCZ_Discrete:DUO_LED_C: Two color LED witch common cathode
Q1 = crystal:CRYSTAL: CRYSTAL
Q2 Q4 Q5 Q7-Q10 = transistor-small-signal:BSS123: N-CHANNEL MOS FET
R1-R34 R36-R73 R75-R85 = _ALCZ_Passives:R: RESISTOR chip
R35 = _ALCZ_Passives:R-TRIM: trimmers
R74 = rcl:R-EU_: RESISTOR, European symbol
S1 = _ALCZ_Switch:SLIDE_SWITCH_THRUHOLE: Thruhole switches by Martin Stejskal
S2 = _ALCZ_Switch:SLIDE_SWITCH_THRUHOLE_1_POLE: Thruhole switches by Martin Stejskal
SV1 SV2 = con-ml:ML14L: HARTING
SW1 = _ALCZ_Switch:B1720: Tact switch 12V 0.05A, SMD
TP1-TP24 = testpad:PTR1: TEST PIN
X1 = con-berg:PN61729-S: BERG USB connector
X2 = _ALCZ_Conectors:JACK_CON_3.5MM_3PIN: Standard 3.5 jack female connector